# EAGLE design NS_ARM_Control_07_15_2017_full (EAGLE 6.6.0)
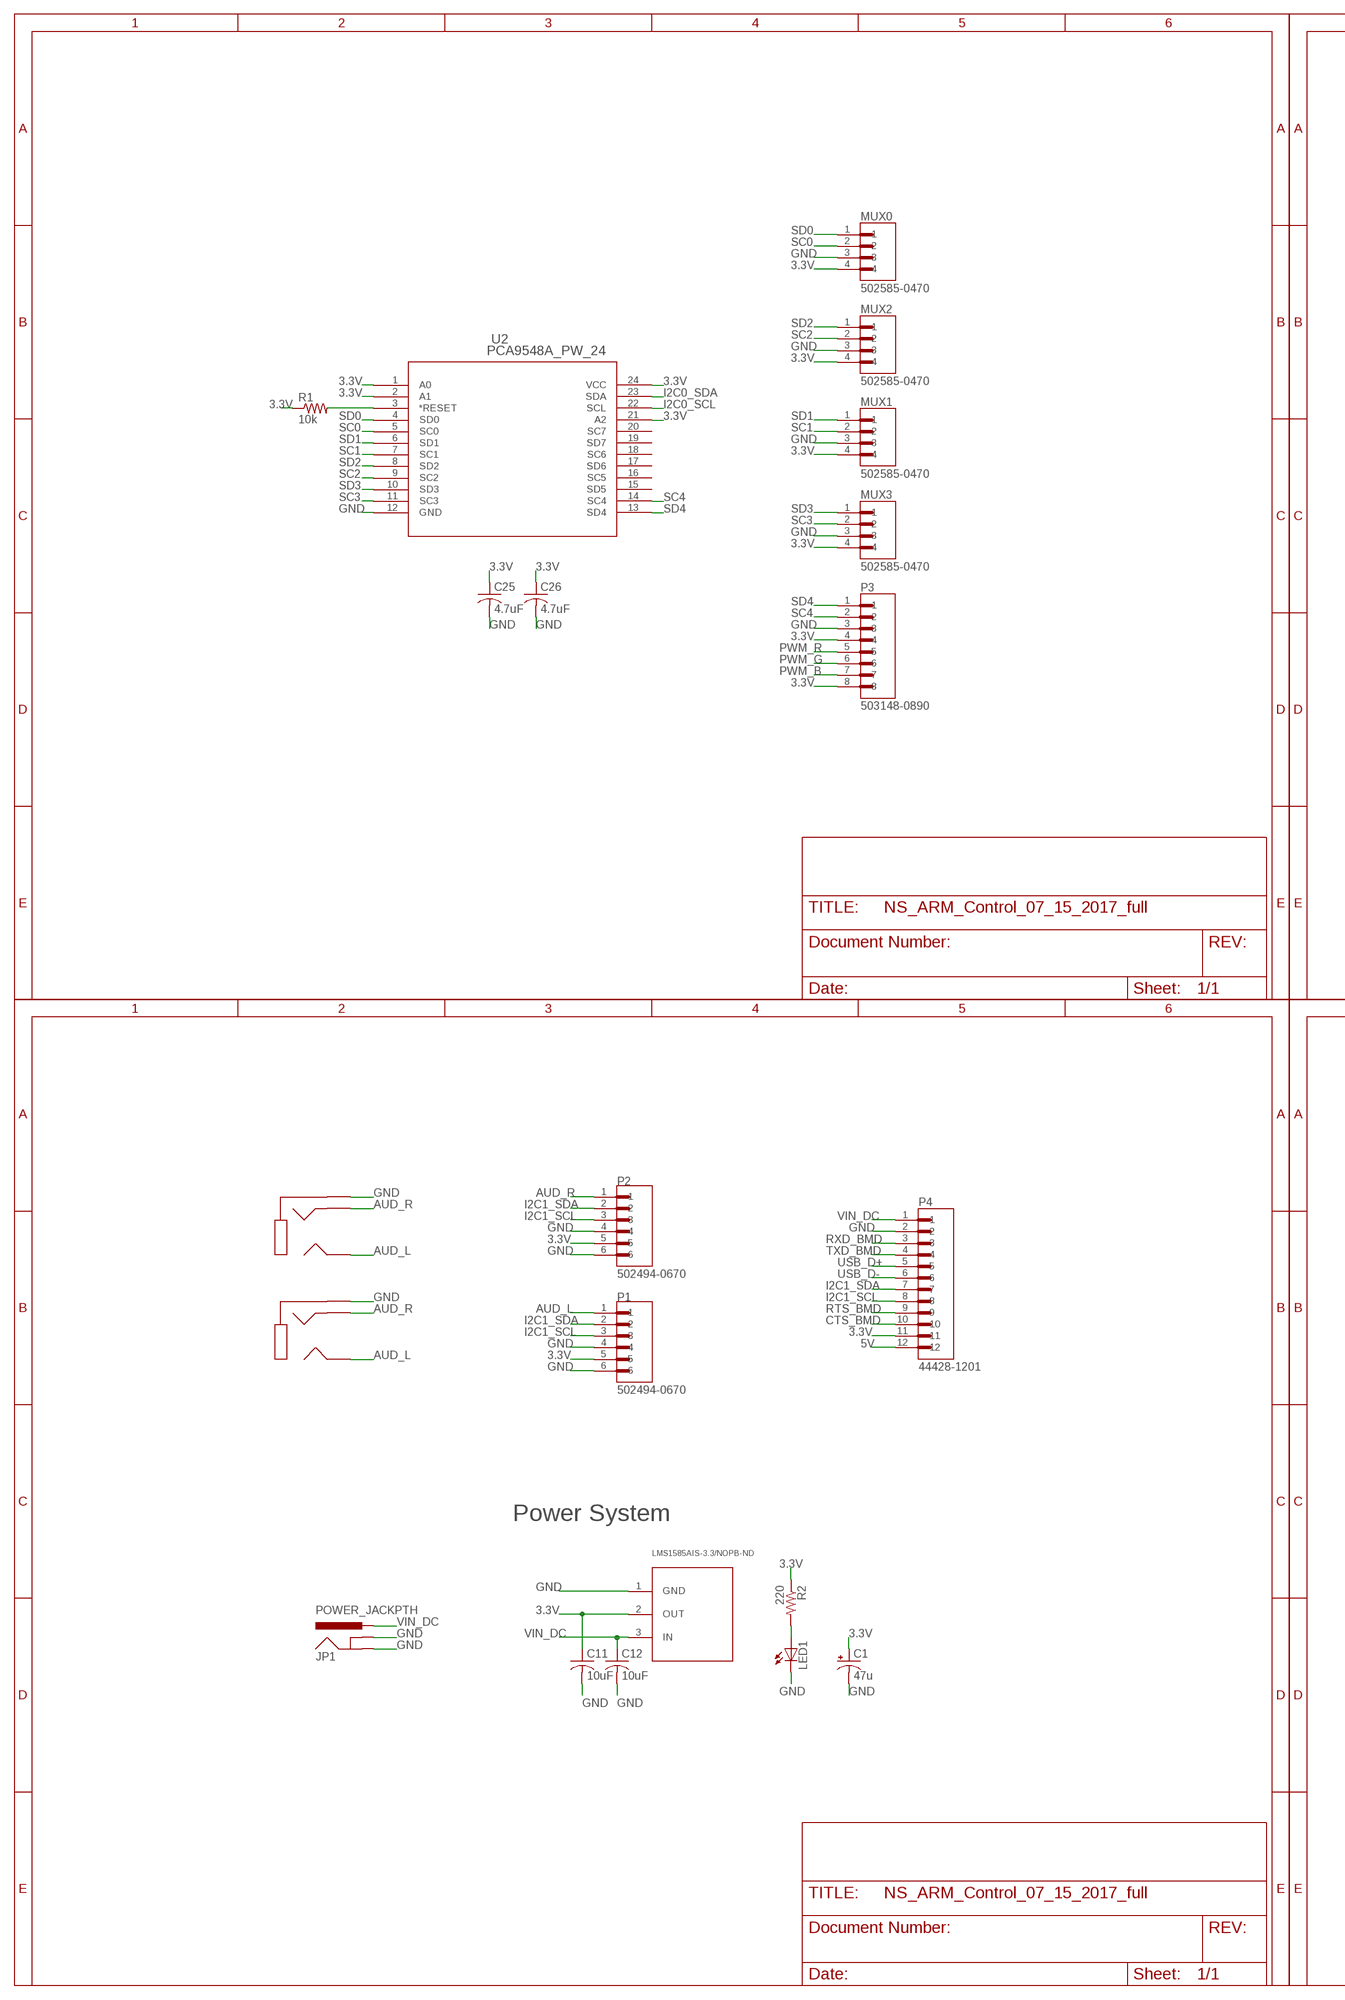
[diagram p0: schematic, sheet 1, part 1 of 2]
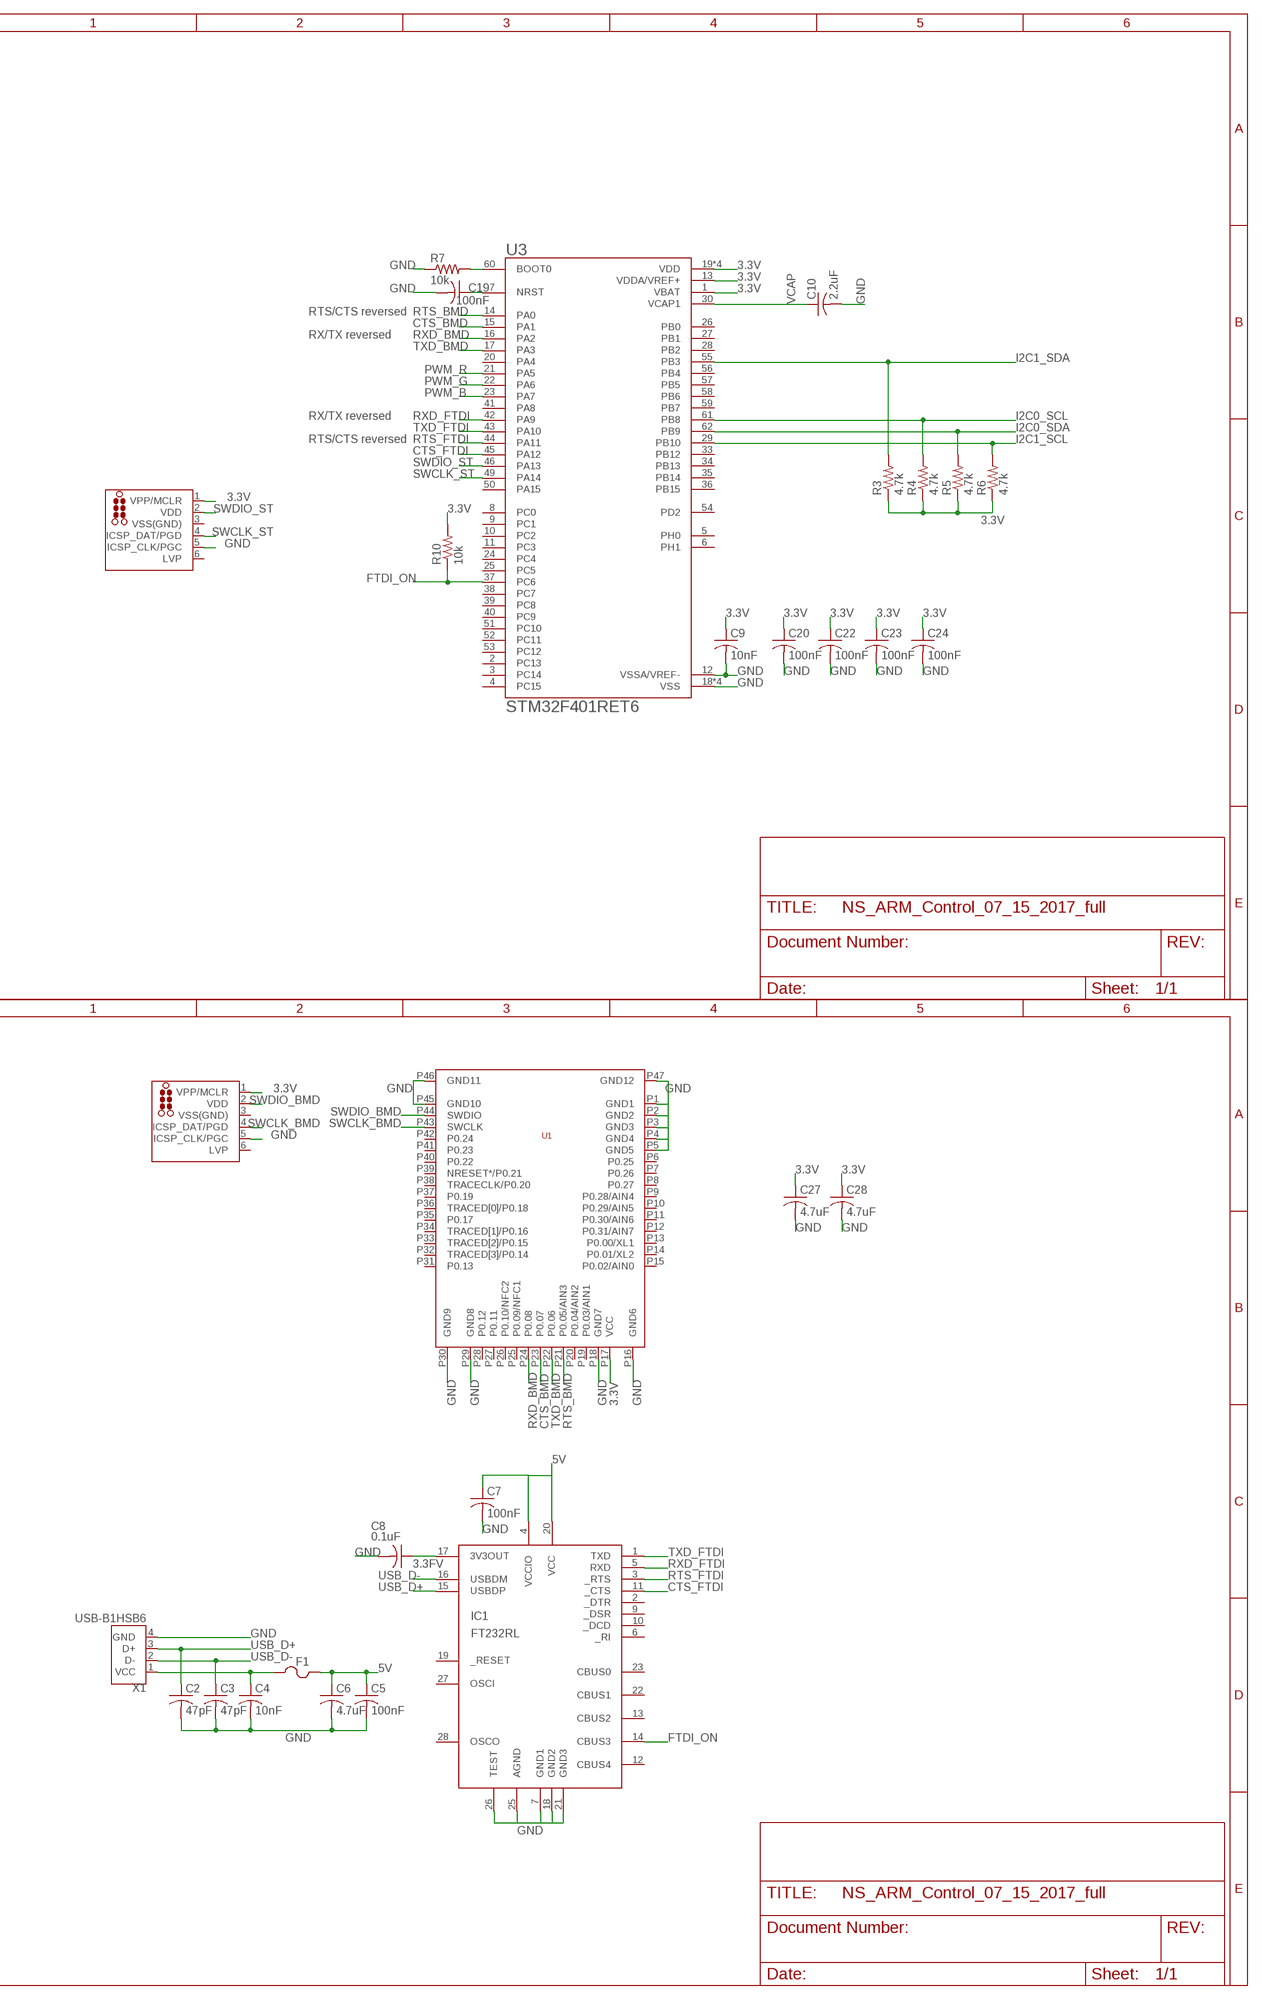
[diagram p1: schematic, sheet 1, part 2 of 2]

## Parts
C1  47u  CAP_POLD  [PANASONIC_D]
C2  47pF  C-USC0402  [C0402]
C3  47pF  C-USC0402  [C0402]
C4  10nF  C-USC0402  [C0402]
C5  100nF  C-USC0402  [C0402]
C6  4.7uF  C-USC0402  [C0402]
C7  100nF  C-USC0402  [C0402]
C8  0.1uF  C-USC0402  [C0402]
C9  10nF  C-USC0402  [C0402]
C10  2.2uF  C-USC0402  [C0402]
C11  10uF  C-USC0603  [C0603]
C12  10uF  C-USC0603  [C0603]
C19  100nF  C-USC0402  [C0402]
C20  100nF  C-USC0402  [C0402]
C22  100nF  C-USC0402  [C0402]
C23  100nF  C-USC0402  [C0402]
C24  100nF  C-USC0402  [C0402]
C25  4.7uF  C-USC0402  [C0402]
C26  4.7uF  C-USC0402  [C0402]
C27  4.7uF  C-USC0402  [C0402]
C28  4.7uF  C-USC0402  [C0402]
F1  1206L050YR  [1206LSERIES]
IC1  FT232RL  [SSOP28DB]
J_BMD  TC2030-MCP-NL  [TC2030-MCP-NL]
J_ST  TC2030-MCP-NL  [TC2030-MCP-NL]
JP1  POWER_JACKPTH  [POWER_JACK_PTH]
LED1  LEDCHIP-LED0603  [CHIP-LED0603]
MUX0  502585-0470  [MOLEX_502585-0470]
MUX1  502585-0470  [MOLEX_502585-0470]
MUX2  502585-0470  [MOLEX_502585-0470]
MUX3  502585-0470  [MOLEX_502585-0470]
P1  502494-0670  [MOLEX_502494-0670]
P2  502494-0670  [MOLEX_502494-0670]
P3  503148-0890  [MOLEX_503148-0890]
P4  44428-1201  [MOLEX_44428-1201]
R1  10k  R-US_R0603  [R0603]
R2  220  R-US_R0402  [R0402]
R3  4.7k  R-US_R0402  [R0402]
R4  4.7k  R-US_R0402  [R0402]
R5  4.7k  R-US_R0402  [R0402]
R6  4.7k  R-US_R0402  [R0402]
R7  10k  R-US_R0402  [R0402]
R10  10k  R-US_R0402  [R0402]
U1  BMD-300  [BMD-300]
U2  PCA9548A_PW_24  [PW24]
U3  STM32F401RET6  [QFP50P1200X1200X160-64N]
U$3  SJ1-3513N  [SJ1-351XN]
U$4  SJ1-3513N  [SJ1-351XN]
U$6  LMS1585AIS-3.3/NOPB-ND  [TO254P1524X483-4N]
X1  USB-B1HSB6  [OST_USB-B1HSB6]

## Nets
3.3FV: C8.1 IC1.17(3V3OUT)
3.3V: C1.+ C9.1 C11.1 C20.1 C22.1 C23.1 C24.1 C25.1 C26.1 C27.1 C28.1 J_BMD.1(VPP/MCLR) J_ST.1(VPP/MCLR) MUX0.4 MUX1.4 MUX2.4 MUX3.4 P1.5 P2.5 P3.4 P3.8 P4.11 R1.1 R2.1 R3.1 R4.1 R5.1 R6.1 R10.2 U1.P17(VCC) U2.1(A0) U2.2(A1) U2.21(A2) U2.24(VCC) U3.1(VBAT) U3.13(VDDA/VREF+) U3.19(VDD) U3.32(VDD) U3.48(VDD) U3.64(VDD) U$6.2(OUT)
5V: C5.1 C6.1 C7.1 F1.2 IC1.4(VCCIO) IC1.20(VCC) P4.12
AUD_L: P1.1 U$3.2 U$4.2
AUD_R: P2.1 U$3.3 U$4.3
CTS_BMD: P4.10 U1.P23(P0.07) U3.15(PA1)
CTS_FTDI: IC1.11(_CTS) U3.45(PA12)
FTDI_ON: IC1.14(CBUS3) R10.1 U3.37(PC6)
GND: C1.- C2.2 C3.2 C4.2 C5.2 C6.2 C7.2 C8.2 C9.2 C10.2 C11.2 C12.2 C19.2 C20.2 C22.2 C23.2 C24.2 C25.2 C26.2 C27.2 C28.2 IC1.7(GND1) IC1.18(GND2) IC1.21(GND3) IC1.25(AGND) IC1.26(TEST) J_BMD.5(ICSP_CLK/PGC) J_ST.5(ICSP_CLK/PGC) JP1.GND JP1.GNDBREAK LED1.C MUX0.3 MUX1.3 MUX2.3 MUX3.3 P1.4 P1.6 P2.4 P2.6 P3.3 P4.2 R7.1 U1.P1(GND1) U1.P2(GND2) U1.P3(GND3) U1.P4(GND4) U1.P5(GND5) U1.P16(GND6) U1.P18(GND7) U1.P29(GND8) U1.P30(GND9) U1.P45(GND10) U1.P46(GND11) U1.P47(GND12) U2.12(GND) U3.12(VSSA/VREF-) U3.18(VSS) U3.31(VSS) U3.47(VSS) U3.63(VSS) U$3.1 U$4.1 U$6.1(GND) X1.4(GND)
I2C0_SCL: R4.2 U2.22(SCL) U3.61(PB8)
I2C0_SDA: R5.2 U2.23(SDA) U3.62(PB9)
I2C1_SCL: P1.3 P2.3 P4.8 R6.2 U3.29(PB10)
I2C1_SDA: P1.2 P2.2 P4.7 R3.2 U3.55(PB3)
N$1: R1.2 U2.3(*RESET)
N$2: C4.1 F1.1 X1.1(VCC)
N$3: LED1.A R2.2
N$4: C19.1 U3.7(NRST)
N$5: R7.2 U3.60(BOOT0)
PWM_B: P3.7 U3.23(PA7)
PWM_G: P3.6 U3.22(PA6)
PWM_R: P3.5 U3.21(PA5)
RTS_BMD: P4.9 U1.P21(P0.05/AIN3) U3.14(PA0)
RTS_FTDI: IC1.3(_RTS) U3.44(PA11)
RXD_BMD: P4.3 U1.P24(P0.08) U3.16(PA2)
RXD_FTDI: IC1.5(RXD) U3.42(PA9)
SC0: MUX0.2 U2.5(SC0)
SC1: MUX1.2 U2.7(SC1)
SC2: MUX2.2 U2.9(SC2)
SC3: MUX3.2 U2.11(SC3)
SC4: P3.2 U2.14(SC4)
SD0: MUX0.1 U2.4(SD0)
SD1: MUX1.1 U2.6(SD1)
SD2: MUX2.1 U2.8(SD2)
SD3: MUX3.1 U2.10(SD3)
SD4: P3.1 U2.13(SD4)
SWCLK_BMD: J_BMD.4(ICSP_DAT/PGD) U1.P43(SWCLK)
SWCLK_ST: J_ST.4(ICSP_DAT/PGD) U3.49(PA14)
SWDIO_BMD: J_BMD.2(VDD) U1.P44(SWDIO)
SWDIO_ST: J_ST.2(VDD) U3.46(PA13)
TXD_BMD: P4.4 U1.P22(P0.06) U3.17(PA3)
TXD_FTDI: IC1.1(TXD) U3.43(PA10)
USB_D+: C2.1 IC1.15(USBDP) P4.5 X1.3(D+)
USB_D-: C3.1 IC1.16(USBDM) P4.6 X1.2(D-)
VCAP: C10.1 U3.30(VCAP1)
VIN_DC: C12.1 JP1.PWR P4.1 U$6.3(IN)
Unconnected: IC1.2(_DTR) IC1.6(_RI) IC1.9(_DSR) IC1.10(_DCD) IC1.12(CBUS4) IC1.13(CBUS2) IC1.19(_RESET) IC1.22(CBUS1) IC1.23(CBUS0) IC1.27(OSCI) IC1.28(OSCO) J_BMD.6(LVP) J_ST.6(LVP) U1.P6(P0.25) U1.P7(P0.26) U1.P8(P0.27) U1.P9(P0.28/AIN4) U1.P10(P0.29/AIN5) U1.P11(P0.30/AIN6) U1.P12(P0.31/AIN7) U1.P13(P0.00/XL1) U1.P14(P0.01/XL2) U1.P15(P0.02/AIN0) U1.P19(P0.03/AIN1) U1.P20(P0.04/AIN2) U1.P25(P0.09/NFC1) U1.P26(P0.10/NFC2) U1.P27(P0.11) U1.P28(P0.12) U1.P31(P0.13) U1.P32(TRACED[3]/P0.14) U1.P33(TRACED[2]/P0.15) U1.P34(TRACED[1]/P0.16) U1.P35(P0.17) U1.P36(TRACED[0]/P0.18) U1.P37(P0.19) U1.P38(TRACECLK/P0.20) U1.P39(NRESET*/P0.21) U1.P40(P0.22) U1.P41(P0.23) U1.P42(P0.24) U2.15(SD5) U2.16(SC5) U2.17(SD6) U2.18(SC6) U2.19(SD7) U2.20(SC7) U3.2(PC13) U3.3(PC14) U3.4(PC15) U3.5(PH0) U3.6(PH1) U3.8(PC0) U3.9(PC1) U3.10(PC2) U3.11(PC3) U3.20(PA4) U3.24(PC4) U3.25(PC5) U3.26(PB0) U3.27(PB1) U3.28(PB2) U3.33(PB12) U3.34(PB13) U3.35(PB14) U3.36(PB15) U3.38(PC7) U3.39(PC8) U3.40(PC9) U3.41(PA8) U3.50(PA15) U3.51(PC10) U3.52(PC11) U3.53(PC12) U3.54(PD2) U3.56(PB4) U3.57(PB5) U3.58(PB6) U3.59(PB7)

## Notes on the sheet
- RTS/CTS reversed
- RX/TX reversed
- RX/TX reversed
- RTS/CTS reversed
- Power System

## Power pins joined to a net without a drawn wire
VSS(GND): J_BMD.3(VSS(GND)) J_ST.3(VSS(GND))

## Library data of the parts
C1 = SparkFun-Capacitors:CAP_POL: Capacitor Polarized These are standard SMD and PTH capacitors. Normally 10uF, 47uF, and 100uF in electrolytic and tantalum varieties. Always verify the external diameter of the through hole cap, it varies with capacity, voltage, and manufacturer. The EIA devices should be standard.
C2-C12 C19 C20 C22-C28 = rcl:C-US: CAPACITOR, American symbol
F1 = 1206L050:1206L050YR; COPYRIGHT: Copyright C 2015 Accelerated Designs. All rights reserved; MANUFACTURER_PART_NUMBER: 1206L050YR; VENDOR: Littelfuse Inc
IC1 = ftdichip-3:FT232RL: USB UART 4th Generation USB UART (USB <-> Serial) Controller
J_BMD J_ST = tag-connect:TC2030: TAG-CONNECT ICSP Connector Manufacturer: Tag-Connect <http://www.tag-connect.com> Cable for easy In-Circuit Serial Programming. Designed for Microchip ICD2, suitable for many others. Two variants - one "with legs" (for hands-free fit on PCB) and another "without legs" for quick programming. PAD Description 1 MCLR/Vpp 2 Vdd 3 GND 4 PGD (ISPDAT) 5 PGC (ISPCLK) 6 nc (used for LVP) ©2009 ROFA.cz - modified and updated by Robert Darlington ‹rdarlington@gmail.com›
JP1 = SparkFun-Connectors:POWER_JACK: Power Jack This is the standard 5.5mm barrel jack for power. The PTH is the most common, proven, reliable, footprint. The Slot footprint only works if the mill layer is transmitted to the PCB fab house so be warned. Mating wall wart : TOL-00298 (and others); PROD_ID: CONN-08197
LED1 = led:LED: LED OSRAM: - CHIPLED LG R971, LG N971, LY N971, LG Q971, LY Q971, LO R971, LY R971 LH N974, LH R974 LS Q976, LO Q976, LY Q976 LO Q996 - Hyper CHIPLED LW Q18S LB Q993, LB Q99A, LB R99A - SideLED LS A670, LO A670, LY A670, LG A670, LP A670 LB A673, LV A673, LT A673, LW A673 LH A674 LY A675 LS A676, LA A676, LO A676, LY A676, LW A676 LS A679, LY A679, LG A679 - Hyper Micro SIDELED® LS Y876, LA Y876, LO Y876, LY Y876 LT Y87S - SmartLED LW L88C, LW L88S LB L89C, LB L89S, LG L890 LS L89K, LO L89K, LY L89K LS L896, LA L896, LO L896, LY L896 - TOPLED LS T670, LO T670, LY T670, LG T670, LP T670 LSG T670, LSP T670, LSY T670, LOP T670, LYG T670 LG T671, LOG T671, LSG T671 LB T673, LV T673, LT T673, LW T673 LH T674 LS T676, LA T676, LO T676, LY T676, LB T676, LH T676, LSB T676, LW T676 LB T67C, LV T67C, LT T67C, LS T67K, LO T67K, LY T67K, LW E67C LS E67B, LA E67B, LO E67B, LY E67B, LB E67C, LV E67C, LT E67C LW T67C LS T679, LY T679, LG T679 LS T770, LO T770, LY T770, LG T770, LP T770 LB T773, LV T773, LT T773, LW T773 LH T774 LS E675, LA E675, LY E675, LS T675 LS T776, LA T776, LO T776, LY T776, LB T776 LHGB T686 LT T68C, LB T68C - Hyper Mini TOPLED® LB M676 - Mini TOPLED Santana® LG M470 LS M47K, LO M47K, LY M47K Source: http://www.osram.convergy.de LUXEON: - LUMILED® LXK2-PW12-R00, LXK2-PW12-S00, LXK2-PW14-U00, LXK2-PW14-V00 LXK2-PM12-R00, LXK2-PM12-S00, LXK2-PM14-U00 LXK2-PE12-Q00, LXK2-PE12-R00, LXK2-PE12-S00, LXK2-PE14-T00, LXK2-PE14-U00 LXK2-PB12-K00, LXK2-PB12-L00, LXK2-PB12-M00, LXK2-PB14-N00, LXK2-PB14-P00, LXK2-PB14-Q00 LXK2-PR12-L00, LXK2-PR12-M00, LXK2-PR14-Q00, LXK2-PR14-R00 LXK2-PD12-Q00, LXK2-PD12-R00, LXK2-PD12-S00 LXK2-PH12-R00, LXK2-PH12-S00 LXK2-PL12-P00, LXK2-PL12-Q00, LXK2-PL12-R00 Source: www.luxeon.com KINGBRIGHT: KA-3528ASYC Source: www.kingbright.com
MUX0 MUX1-MUX3 = 502585-0470:502585-0470: 1.50mm Pitch CLIK-Mate™ Wire-to-Board PCB Receptacle, Single Row, Right Angle, 4 Circuits; AVAILABILITY: Good; DESCRIPTION: 1.50mm Pitch CLIK-Mate™ Wire-to-Board PCB Receptacle, Single Row, Right Angle, 4 Circuits; MF: Molex; MP: 502585-0470; PACKAGE: None; PRICE: 0.44 USD
P1 P2 = 502494-0670:502494-0670: 2.00mm Pitch CLIK-Mate™ Wire-to-Board PCB Receptacle, Single Row, Right Angle, 6 Circuits; AVAILABILITY: Good; DESCRIPTION: 2.00mm Pitch CLIK-Mate™ Wire-to-Board PCB Receptacle, Single Row, Right Angle, 6 Circuits; MF: Molex; MP: 502494-0670; PACKAGE: None; PRICE: 0.53 USD
P3 = 503148-0890:503148-0890: 1.5wb Dual r/a Embs Tape Pkg 8p; AVAILABILITY: Good; DESCRIPTION: 1.5wb Dual r/a Embs Tape Pkg 8p; MF: Molex; MP: 503148-0890; PACKAGE: None; PRICE: 1.11 USD
P4 = 44428-1201:44428-1201: Conn Wire to Board HDR 12 POS 3mm Solder RA Thru-Hole Micro-Fit 3.0 BMI? Tray; AVAILABILITY: Good; DESCRIPTION: Conn Wire to Board HDR 12 POS 3mm Solder RA Thru-Hole Micro-Fit 3.0 BMI? Tray; MF: Molex; MP: 44428-1201; PACKAGE: None; PRICE: 2.39 USD
R1 = resistor:R-US_: RESISTOR, American symbol
R2-R7 R10 = rcl:R-US_: RESISTOR, American symbol
U1 = BMD-300:BMD-300
U2 = PCA9548A_PW_124:PCA9548A_PW_24; DATASHEETURL: http://www.ti.com/lit/gpn/PCA9548A; DESCRIPTION: 8-Channel I2C Switch With Reset; FAMILY_NAME: I2C MULTIPLEXER, SWITCH; GENERIC_PART_NUMBER: PCA9548A; INDUSTRY_STD_PKG_TYPE: TSSOP; MANUFACTURER: Texas Instruments; MANUFACTURER_PART_NUMBER: pca9548a_pw_24; PACKAGE_DESIGNATOR: PW; PIN_COUNT: 24; VENDOR: Texas Instruments
U3 = STM32F401RET6:STM32F401RET6: MCU 32-Bit STM32 ARM Cortex M4 RISC 512KB Flash 1.8V/2.5V/3.3V 64-Pin LQFP Tray; AVAILABILITY: Good; DESCRIPTION: MCU 32-Bit STM32 ARM Cortex M4 RISC 512KB Flash 1.8V/2.5V/3.3V 64-Pin LQFP Tray; MF: STMicroelectronics; MP: STM32F401RET6; PACKAGE: LQFP-64 STMicroelectronics; PRICE: 4.74 USD
U$3 U$4 = audio_mux:SJ1-3513N
U$6 = TO254P1524X483-4N:LMS1585AIS-3.3/NOPB-ND
X1 = USB-B1HSB6:USB-B1HSB6: Conn Usb Type b r/a Black; AVAILABILITY: Warning; DESCRIPTION: Conn Usb Type b r/a Black; MF: On Shore Technology; MP: USB-B1HSB6; PACKAGE: None; PRICE: 0.42 USD

## Board
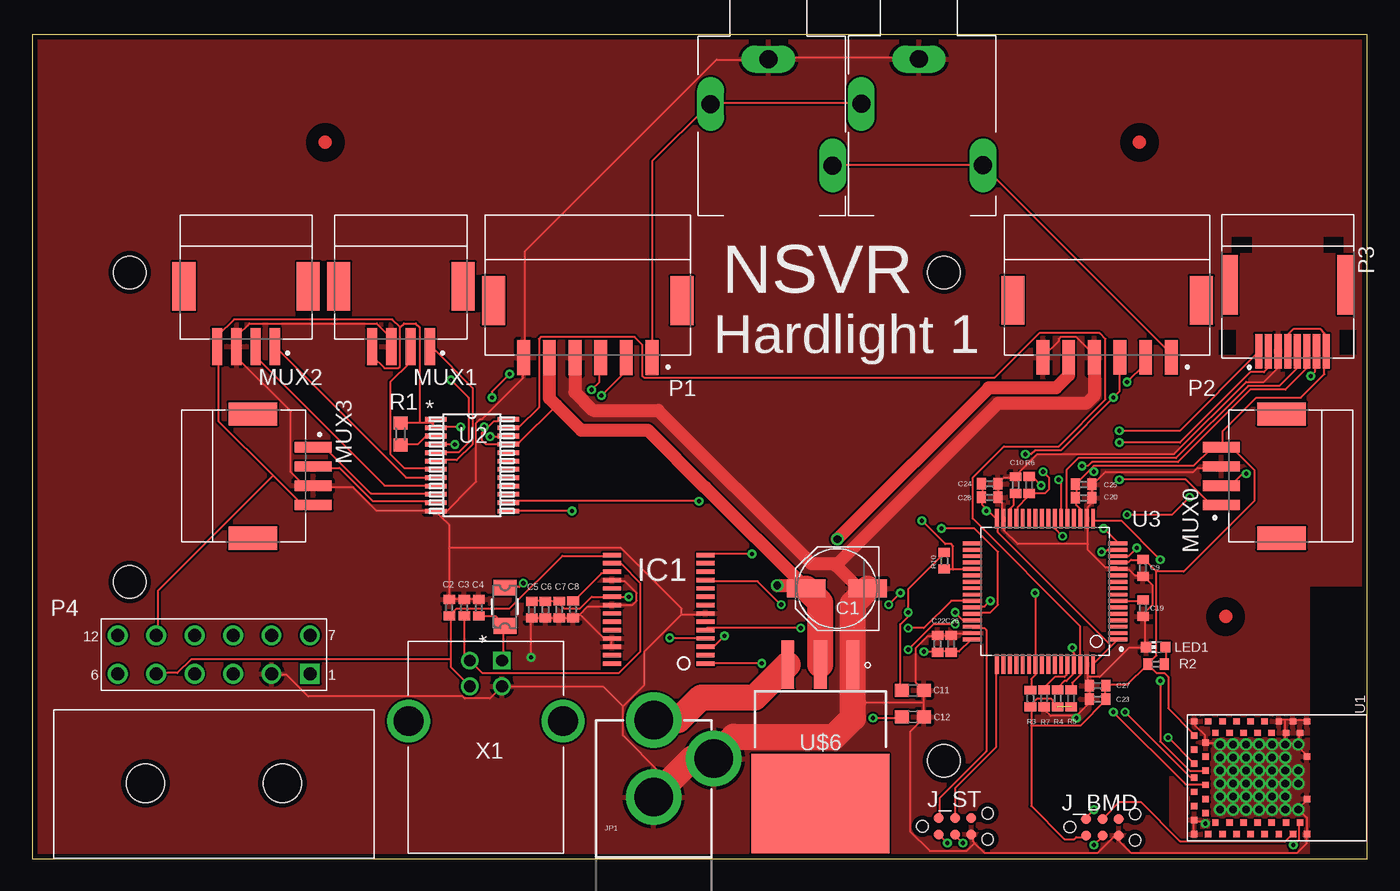
[diagram p2: board, top side]
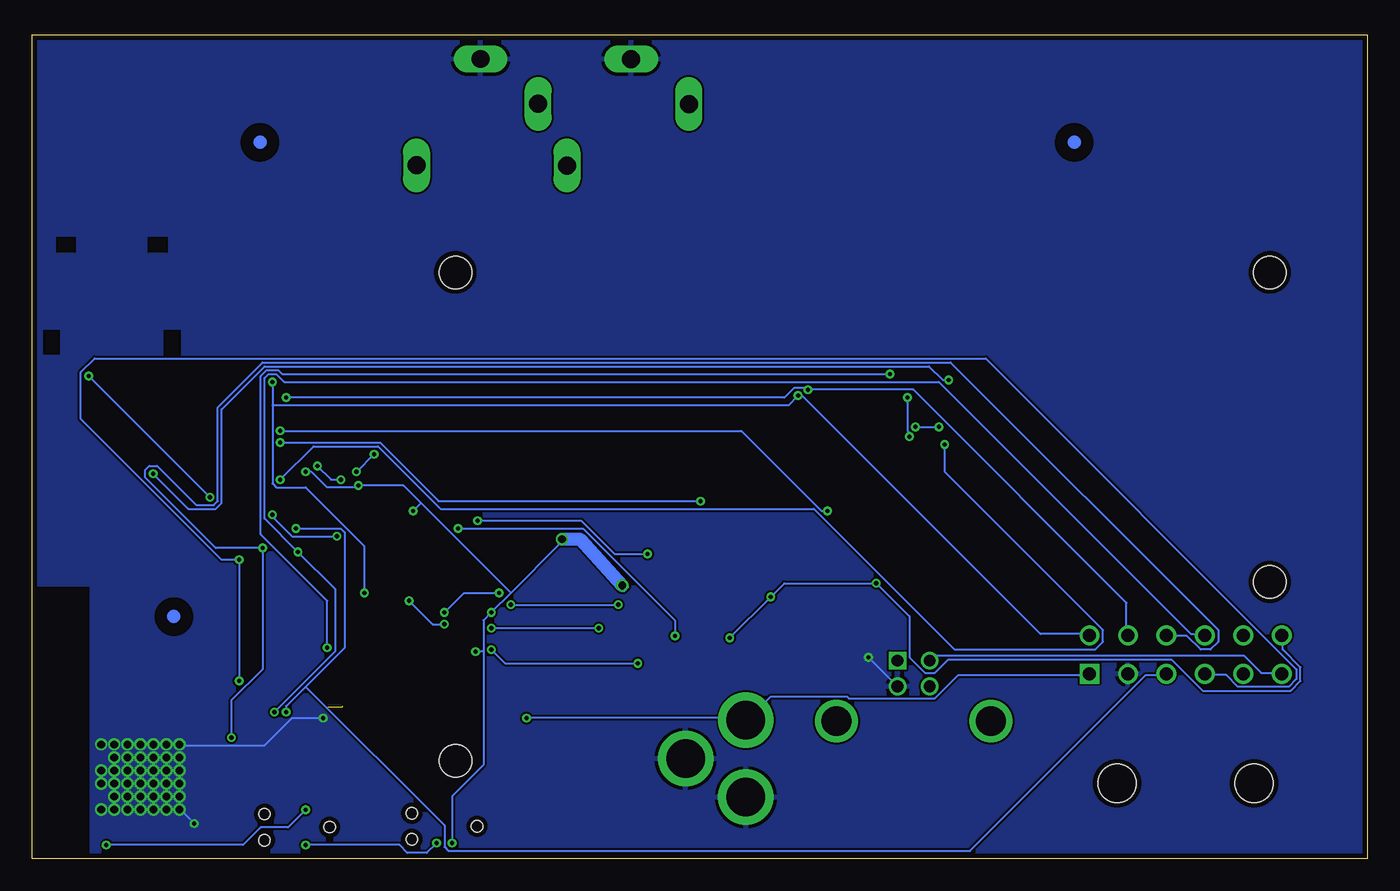
[diagram p3: board, bottom side, seen from below]

Size 104.14 x 64.26 mm. Coordinates in mm from the lower left corner, seen from the top.
Outline: 104.14,0 104.14,64.26 0,64.26 0,0 104.14,0
Copper layers (1*16): Top 0.0356mm / dielectric 1.5011mm / Bottom 0.0356mm
Design rules "LaenPCBOrder (OSH Park)": minimum track width 6mil, minimum drill 13mil, track to track 6mil, track to pad 6mil, pad to pad 6mil, via to via 6mil, smd to smd 6mil, copper to edge 15mil, drill to drill 6mil, minimum pad ring 7mil, minimum via ring 7mil, stop-mask expansion 3mil, vias tented up to drill 0mil, thermal gap 10mil
Holes 2.54 mm at 71.12,45.72 7.62,45.72 71.12,7.62 7.62,21.59

### Footprints (pad centres in the part's own frame; a part is rotated, then mirrored left to right if it is on the bottom)
PANASONIC_D = smd 3 x 1.4: + 2.4,0; - -2.4,0
C0402 = smd 0.7 x 0.9: 1 -0.65,0; 2 0.65,0
C0603 = smd 1.1 x 1: 1 -0.85,0; 2 0.85,0
1206LSERIES = smd 1.219 x 1.778: 1 -1.499,0; 2 1.499,0
SSOP28DB = smd 0.348 x 1.397: 1 -4.225,-3.656; 2 -3.575,-3.656; 3 -2.925,-3.656; 4 -2.275,-3.656; 5 -1.625,-3.656; 6 -0.975,-3.656; 7 -0.325,-3.656; 8 0.325,-3.656; 9 0.975,-3.656; 10 1.625,-3.656; 11 2.275,-3.656; 12 2.925,-3.656; 13 3.575,-3.656; 14 4.225,-3.656; 15 4.225,3.656; 16 3.575,3.656; 17 2.925,3.656; 18 2.275,3.656; 19 1.625,3.656; 20 0.975,3.656; 21 0.325,3.656; 22 -0.325,3.656; 23 -0.975,3.656; 24 -1.625,3.656; 25 -2.275,3.656; 26 -2.925,3.656; 27 -3.575,3.656; 28 -4.225,3.656
TC2030-MCP-NL = smd 0.787 x 0.787: 1 1.27,-0.635; 2 1.27,0.635; 3 2.54,-0.635; 4 2.54,0.635; 5 3.81,-0.635; 6 3.81,0.635 | hole 0.889: 0,0; 5.08,-1.016; 5.08,1.016
POWER_JACK_PTH = drill 2.997 pad 4.318: GND 0,7.7; GNDBREAK 4.7,10.7; PWR 0,13.7
CHIP-LED0603 = smd 0.8 x 0.8: A 0,-0.75; C 0,0.75
MOLEX_502585-0470 = smd 0.8 x 2.9: 1 -2.25,0; 2 -0.75,0; 3 0.75,0; 4 2.25,0 | smd 1.8 x 3.8: P1 -4.85,-4.7; P2 4.85,-4.7
MOLEX_502494-0670 = smd 1 x 2.7: 1 -5,0; 2 -3,0; 3 -1,0; 4 1,0; 5 3,0; 6 5,0 | smd 1.8 x 3.8: P1 -7.35,-4.45; P2 7.35,-4.45
MOLEX_503148-0890 = smd 0.55 x 2.7: 1 2.25,0; 2 1.5,0; 3 0.75,0; 4 0,0; 5 -0.75,0; 6 -1.5,0; 7 -2.25,0; 8 -3,0 | smd 1.2 x 4.65: P1 -4.48,-5.175; P2 4.48,-5.175
MOLEX_44428-1201 = drill 1.02 square: 1 7.5,5.065 | drill 1.02: 2 4.5,5.065; 3 1.5,5.065; 4 -1.5,5.065; 5 -4.5,5.065; 6 -7.5,5.065; 7 7.5,8.065; 8 4.5,8.065; 9 1.5,8.065; 10 -1.5,8.065; 11 -4.5,8.065; 12 -7.5,8.065 | hole 3: -5.34,-3.465; 5.34,-3.465
R0603 = smd 1 x 1.1: 1 -0.85,0; 2 0.85,0
R0402 = smd 0.7 x 0.9: 1 -0.65,0; 2 0.65,0
BMD-300 = smd 0.5 x 0.5: P1 0.5,9.35; P2 1.4,8.8; P3 0.5,8.25; P4 1.4,7.7; P5 0.5,7.15; P6 1.4,6.6; P7 0.5,6.05; P8 1.4,5.5; P9 0.5,4.95; P10 1.4,4.4; P11 0.5,3.85; P12 1.4,3.3; P13 0.5,2.75; P14 1.4,2.2; P15 0.5,1.65; P16 0.5,0.55; P17 1.6,0.55; P18 2.15,1.45; P19 2.7,0.55; P20 3.25,1.45; P21 3.8,0.55; P22 4.35,1.45; P23 4.9,0.55; P24 5.45,1.45; P25 6,0.55; P26 6.55,1.45; P27 7.1,0.55; P28 7.65,1.45; P29 8.2,0.55; P30 9.3,0.55; P31 9.3,1.65; P32 8.4,2.2; P33 9.3,2.75; P34 8.4,3.3; P35 9.3,3.85; P36 8.4,4.4; P37 9.3,4.95; P38 8.4,5.5; P39 9.3,6.05; P40 8.4,6.6; P41 9.3,7.15; P42 8.4,7.7; P43 9.3,8.25; P44 8.4,8.8; P45 9.3,9.35; P46 6.55,9.35; P47 3.25,9.35
PW24 = smd 1.676 x 0.356: 1 -2.819,3.575; 2 -2.819,2.925; 3 -2.819,2.275; 4 -2.819,1.625; 5 -2.819,0.975; 6 -2.819,0.325; 7 -2.819,-0.325; 8 -2.819,-0.975; 9 -2.819,-1.625; 10 -2.819,-2.275; 11 -2.819,-2.925; 12 -2.819,-3.575; 13 2.819,-3.575; 14 2.819,-2.925; 15 2.819,-2.275; 16 2.819,-1.625; 17 2.819,-0.975; 18 2.819,-0.325; 19 2.819,0.325; 20 2.819,0.975; 21 2.819,1.625; 22 2.819,2.275; 23 2.819,2.925; 24 2.819,3.575
QFP50P1200X1200X160-64N = smd 1.5 x 0.3: 1 -5.67,3.75; 2 -5.67,3.25; 3 -5.67,2.75; 4 -5.67,2.25; 5 -5.67,1.75; 6 -5.67,1.25; 7 -5.67,0.75; 8 -5.67,0.25; 9 -5.67,-0.25; 10 -5.67,-0.75; 11 -5.67,-1.25; 12 -5.67,-1.75; 13 -5.67,-2.25; 14 -5.67,-2.75; 15 -5.67,-3.25; 16 -5.67,-3.75; 33 5.67,-3.75; 34 5.67,-3.25; 35 5.67,-2.75; 36 5.67,-2.25; 37 5.67,-1.75; 38 5.67,-1.25; 39 5.67,-0.75; 40 5.67,-0.25; 41 5.67,0.25; 42 5.67,0.75; 43 5.67,1.25; 44 5.67,1.75; 45 5.67,2.25; 46 5.67,2.75; 47 5.67,3.25; 48 5.67,3.75 | smd 0.3 x 1.5: 17 -3.75,-5.67; 18 -3.25,-5.67; 19 -2.75,-5.67; 20 -2.25,-5.67; 21 -1.75,-5.67; 22 -1.25,-5.67; 23 -0.75,-5.67; 24 -0.25,-5.67; 25 0.25,-5.67; 26 0.75,-5.67; 27 1.25,-5.67; 28 1.75,-5.67; 29 2.25,-5.67; 30 2.75,-5.67; 31 3.25,-5.67; 32 3.75,-5.67; 49 3.75,5.67; 50 3.25,5.67; 51 2.75,5.67; 52 2.25,5.67; 53 1.75,5.67; 54 1.25,5.67; 55 0.75,5.67; 56 0.25,5.67; 57 -0.25,5.67; 58 -0.75,5.67; 59 -1.25,5.67; 60 -1.75,5.67; 61 -2.25,5.67; 62 -2.75,5.67; 63 -3.25,5.67; 64 -3.75,5.67
SJ1-351XN = drill 1.4 long: 1 0.8,0; 2 4.3,-4.5; 3 9.1,5
TO254P1524X483-4N = smd 3.8 x 1: 1 -6.4,2.54; 2 -6.4,0; 3 -6.4,-2.54 | smd 7.75 x 10.75: TAB 4.45,0
OST_USB-B1HSB6 = drill 0.92 square: 1 1.25,4.71 | drill 0.92: 2 -1.25,4.71; 3 -1.25,2.71; 4 1.25,2.71 | drill 2.33: P1 -6.02,0; P2 6.02,0

### Placement (x,y rotation side)
C1  62.78,21.07 180 top
C2  32.53,19.58 90 top
C3  33.7,19.58 90 top
C4  34.84,19.57 90 top
C5  38.97,19.41 270 top
C6  40.04,19.42 270 top
C7  41.12,19.44 270 top
C8  42.19,19.45 270 top
C9  86.63,22.68 270 top
C10  76.71,29.14 90 top
C11  68.69,13.13 0 top
C12  68.7,11.06 0 top
C19  86.63,19.54 270 top
C20  82,28.14 0 top
C22  70.61,16.76 90 top
C23  83.1,12.44 180 top
C24  74.67,29.24 0 top
C25  82,29.19 0 top
C26  71.67,16.76 90 top
C27  83.1,13.5 180 top
C28  74.67,28.18 0 top
F1  36.88,19.65 90 top
IC1  48.87,19.46 90 top
J_BMD  80.93,2.46 0 top
J_ST  69.44,2.52 0 top
JP1  48.47,-2.9 0 top
LED1  87.64,16.5 90 top
MUX0  92.73,29.84 90 top
MUX1  28.76,39.94 180 top
MUX2  16.7,39.95 180 top
MUX3  21.93,29.84 270 top
P1  43.34,39.09 180 top
P2  83.84,39.1 180 top
P3  97.92,39.58 180 top
P4  14.18,9.35 0 top
R1  28.73,33.13 270 top
R2  87.65,15.17 0 top
R3  77.85,12.5 90 top
R4  79.98,12.5 90 top
R5  81.04,12.51 90 top
R6  77.76,29.15 270 top
R7  78.92,12.5 90 top
R10  71.14,23.23 90 top
U1  90.08,11.21 270 top
U2  34.3,30.69 0 top
U3  79,20.84 180 top
U$1  [CIRCLE-1MM-3R]  22.86,55.88 0 top
U$2  [CIRCLE-1MM-3R]  86.36,55.88 0 top
U$3  69.16,63.18 270 top
U$4  57.42,63.16 270 top
U$5  [CIRCLE-1MM-3R]  93.09,18.89 0 top
U$6  61.48,8.74 270 top
X1  35.39,10.73 0 top

### Tracks (layer width: path | path; a pad name or v marks a point on that pad's centre or on a via)
3.3FV
  Top 0.152: C8.1 42.27,20.12 44.4,22.25 45.16,22.25 IC1.17
3.3V  (via drill 0.33, 0.6)  (2 unrouted)
  Top 0.152: 52.17,28.65 52.49,28.97 | 77.93,10.36 77.93,11.73 R3.1 77.78,11.89 78.38,12.5 79.45,12.5 79.6,12.34 79.6,12.19 79.91,11.89 | 77.93,10.36 77.93,4.12 80.52,1.52 81.28,1.52 81.43,1.68 82.19,1.68 J_BMD.1 | U3.13 84.78,23.16 85.55,23.16 85.7,23.32 86.61,23.32 C9.1 86.77,23.32 87.68,22.4 | U1.P17 90.58,9.75 88.59,11.73 88.59,14.17 88.29,14.48 87.68,14.48 87.07,15.09 R2.1 | R2.1 86.92,15.09 85.4,13.56 83.87,13.56 C27.1 83.72,13.41 83.72,12.5 C23.1 83.72,12.34 81.74,10.36 77.93,10.36 | 87.68,22.4 87.68,15.85 87.07,15.24 R2.1 | P3.4 98.04,39.62 98.04,41 98.35,41.3 100.48,41.3 100.79,41 100.79,39.62 P3.8 100.79,39.47 100.79,37.8 98.96,35.97 95.45,35.97 92.86,33.38 92.86,32.16 MUX0.4 | U3.19 81.74,26.52 81.74,27.28 81.43,27.58 81.43,28.04 C20.1 81.43,28.19 81.43,29.11 C25.1 81.43,29.26 82.5,30.33 | 82.5,30.33 82.8,30.63 90.58,30.63 91.95,32 92.71,32 MUX0.4 | 87.68,22.4 89.81,22.4 95.3,27.89 95.3,30.33 93.62,32 92.86,32 MUX0.4 | 31.14,33.98 31.29,33.98 31.44,34.14 U2.1 | 31.14,33.98 30.23,33.98 | 30.23,33.98 28.85,33.98 R1.1 | 31.14,33.98 31.44,33.68 U2.2 31.6,33.68 v33.43,33.68 | 30.23,33.98 30.23,41.45 29.92,41.76 29.01,41.76 28.7,41.45 | 28.7,41.45 28.7,38.41 28.55,38.25 27.48,38.25 26.57,39.17 26.57,39.93 MUX1.4 | 28.7,41.45 28.09,42.06 15.75,42.06 14.53,40.84 14.53,40.08 MUX2.4 14.53,39.93 14.53,34.14 18.8,29.87 | 18.8,29.87 20.93,27.74 21.84,27.74 MUX3.4 | 18.8,29.87 9.8,20.88 9.8,17.53 P4.11 | C24.1 74.12,29.11 74.12,28.19 C28.1 74.12,28.04 74.12,27.58 74.57,27.13 | 74.57,27.13 75.18,26.52 U3.32 75.34,26.36 75.34,25.45 84.18,16.61 | 84.18,16.61 84.63,17.07 U3.1
  Top 0.152: 84.18,16.61 82.8,15.24 U3.64 | R10.2 71.07,23.77 68.33,21.03 v68.33,19.2 68.33,18.9 67.72,18.29 67.72,13.26 C11.1 | U3.48 73.2,17.07 72.29,16.15 71.68,16.15 C26.1 71.53,16.15 70.76,16.15 C22.1 70.61,16.15 v69.55,16.15 | v71.37,1.22 70.76,1.83 J_ST.1 | v78.69,29.11 78.08,29.72 77.78,29.72 R6.1 | 40.89,35.36 38,32.46 37.24,32.46 U2.21 37.08,32.31 35.41,32.31 35.1,32.61 35.1,33.22 35.41,33.53 | 35.41,33.53 36.02,34.14 37.08,34.14 U2.24 | v74.42,27.13 74.57,27.13 | 35.41,33.53 v35.25,33.68 | 82.5,30.33 82.65,30.33 v82.8,30.18
  Top 1.016: P1.5 40.34,35.91 40.89,35.36 42.82,33.43 48.02,33.43 52.49,28.97 C1.+ 60.14,21.31 v58.11,21.31 | P2.5 80.84,37.69 79.86,36.72 74.61,36.72 v62.81,24.92
  Top 2.032: U$6.2 61.48,19.98 C1.+
  Bottom 0.152: 57.96,20.88 v58.11,21.31 57.66,21.18 | v71.37,1.22 71.37,4.88 68.94,7.32 68.94,16.15 | 68.94,16.15 68.94,18.59 v68.33,19.2 66.8,20.73 | 66.8,20.73 62.99,24.54 v62.81,24.92 | 66.8,20.73 73.81,27.74 | 73.81,27.74 75.18,29.11 v78.69,29.11 78.84,28.96 81.13,28.96 82.35,30.18 v82.8,30.18 | 68.94,16.15 v69.55,16.15 | 73.81,27.74 v74.42,27.13 | v35.25,33.68 v33.43,33.68
  Bottom 1.016: v62.81,24.92 61.41,24.92 v58.11,21.31
5V  (via drill 0.33)
  Top 0.152: C5.1 39.06,20.12 39.98,20.12 C6.1 40.13,20.12 41.05,20.12 C7.1 41.05,19.96 41.5,19.51 42.72,19.51 43.64,20.42 45.16,20.42 IC1.20 45.31,20.42 v46.53,20.42 | v49.73,17.22 52.48,17.22 IC1.4 | v38.3,21.49 38,21.18 36.93,21.18 F1.2
  Bottom 0.152: v49.73,17.22 v46.53,20.42 45.47,21.49 v38.3,21.49 35.71,18.9 35.71,15.7 34.49,14.48 33.73,14.48 32.66,15.54 15.29,15.54 12.85,13.11 5.99,13.11 5.23,13.87 5.23,14.94 6.6,16.31 6.6,17.37 P4.12
AUD_L
  Top 0.152: P1.1 48.36,39.17 48.36,54.41 52.78,58.83 U$4.2 52.93,58.98 64.52,58.98 U$3.2
AUD_R
  Top 0.152: P2.1 88.75,39.17 88.75,39.47 74.27,53.95 U$3.3 74.12,54.1 62.53,54.1 U$4.3
CTS_BMD  (via drill 0.33)
  Top 0.152: v85.24,11.43 90.27,6.4 90.58,6.4 U1.P23 | v83.41,23.93 83.72,23.93 83.87,24.08 84.63,24.08 U3.15
  Bottom 0.152: v85.24,11.43 80.52,16.15 80.52,21.03 v83.41,23.93 86,26.52 86,37.49 85.7,37.8 85.09,37.8 84.48,37.19 33.43,37.19 13.77,17.53 12.7,17.53 P4.10
CTS_FTDI  (via drill 0.33)
  Top 0.152: v58.42,19.81 56.59,21.64 52.63,21.64 IC1.11 | v67.72,20.73 v66.8,19.81 | v71.98,19.2 72.59,18.59 73.2,18.59 U3.45
  Bottom 0.152: v66.8,19.81 v58.42,19.81 | v67.72,20.73 70.46,20.73 v71.98,19.2
FTDI_ON  (via drill 0.33)
  Top 0.152: 71.83,22.55 73.2,22.55 U3.37 | 71.83,22.55 71.22,22.55 R10.1 | v56.13,23.77 52.63,23.77 IC1.14 | v69.39,26.36 71.22,24.54 71.68,24.54 71.83,24.38 71.83,22.55
  Bottom 0.152: v56.13,23.77 58.73,23.77 61.32,26.36 v69.39,26.36
GND  (via drill 0.33, 0.6)
  Top 0.152: U$3.1 69.09,62.48 57.51,62.48 U$4.1 57.35,62.33 53.39,62.33 38.46,47.4 38.46,39.17 P1.6 38.3,39.01 38.3,37.49 35.1,34.29 34.95,34.29 34.65,33.98 34.65,29.41 31.9,26.67 | C4.2 34.8,20.27 33.73,20.27 C3.2 33.58,20.27 32.66,20.27 C2.2 32.51,20.27 32.51,24.23 | 32.51,24.23 32.51,26.06 31.9,26.67 | 31.9,26.67 31.6,26.98 U2.12 31.44,27.13 26.87,27.13 25.04,28.96 22,28.96 MUX3.3 21.84,29.11 21.23,29.11 20.17,30.18 20.17,34.9 16.05,39.01 16.05,39.93 MUX2.3 16.05,40.08 16.05,40.84 16.97,41.76 26.87,41.76 27.94,40.69 27.94,40.08 MUX1.3 | 81.43,11.12 79.45,11.12 78.99,11.58 78.99,11.73 R7.1 | 81.43,11.12 82.35,12.04 82.35,12.34 C23.2 82.5,12.5 82.5,13.41 C27.2 82.35,13.56 82.35,14.17 | 82.35,14.17 82.35,15.09 U3.63 | 82.35,24.54 82.35,24.08 83.72,22.71 84.63,22.71 U3.12 84.78,22.55 85.55,22.55 86,22.1 86.61,22.1 C9.2 86.77,21.95 87.38,21.34 87.38,19.81 86.77,19.2 86.77,18.9 C19.2 86.77,18.75 86.77,16.61 LED1.C 86.77,16.46 85.55,16.46 83.26,14.17 82.35,14.17 | 82.35,24.54 82.35,26.36 U3.18 82.35,26.52 82.35,27.43 82.65,27.74 82.65,28.04 C20.2 82.65,28.19 82.65,29.11 C25.2 82.8,29.26 83.72,30.18 90.58,30.18 90.88,30.48 92.71,30.48 MUX0.3 | 82.35,24.54 76.86,24.54 75.79,25.6 75.79,26.36 U3.31 75.64,26.52 75.64,27.74 75.34,28.04 C28.2 75.34,28.19 75.34,29.11 C24.2 75.34,29.26 75.79,29.72 76.56,29.72 C10.2 76.71,29.87 78.38,31.55 89.05,31.55 94.69,37.19 96.06,37.19 97.13,38.25 97.13,39.47 P3.3 | v93.66,3.83 93.78,3.81 94.54,3.81 v94.68,3.83 94.69,3.96 94.69,4.72 v94.68,4.85 94.54,4.88 93.78,4.88 | v93.66,7.89 93.78,7.92 94.54,7.92 v94.68,7.89 94.69,7.77 94.69,7.01 v94.68,6.88
  Top 0.152: v94.68,6.88 94.69,6.86 94.69,5.94 v94.68,5.86 94.54,5.94 93.78,5.94 v93.66,5.86 93.78,5.79 93.78,4.88 | v94.68,6.88 94.54,6.86 93.78,6.86 v93.66,6.88 93.62,6.86 92.71,6.86 | 93.78,4.88 v93.66,4.85 | U1.P30 90.58,1.98 90.58,2.9 U1.P29 90.73,2.9 91.34,2.9 v91.49,2.74 | v92.65,3.83 92.71,3.96 92.71,4.72 v92.65,4.85 92.71,4.88 92.71,5.79 v92.65,5.86 92.71,5.94 92.71,6.86 | v92.65,8.91 92.56,8.99 91.64,8.99 U1.P18 91.49,9.14 91.49,9.6 90.73,10.36 90.73,10.67 U1.P16 | v92.65,8.91 92.71,8.84 92.71,7.92 v92.65,7.89 92.71,7.77 92.71,7.01 v92.65,6.88 92.71,6.86 | v98.74,3.83 98.81,3.81 99.42,3.2 99.42,1.98 U1.P45 99.42,1.83 99.42,1.22 98.65,0.46 85.7,0.46 84.48,1.68 | U1.P46 99.42,4.57 98.81,3.96 v98.74,3.83 | v96.71,3.83 96.83,3.81 97.59,3.81 v97.73,3.83 | v97.73,3.83 97.74,3.96 97.74,4.72 v97.73,4.85 97.59,4.88 96.83,4.88 | v98.74,5.86 98.81,5.94 98.81,6.86 v98.74,6.88 98.65,6.86 97.74,6.86 | v96.71,7.89 96.83,7.92 97.59,7.92 v97.73,7.89 97.74,7.77 97.74,7.01 v97.73,6.88 | 97.74,6.86 97.74,5.94 v97.73,5.86 97.59,5.94 96.83,5.94 v96.71,5.86 96.83,5.79 96.83,4.88 | v97.73,6.88 97.59,6.86 96.83,6.86 v96.71,6.88 96.67,6.86 95.76,6.86 | 97.74,6.86 v97.73,6.88 | 96.83,4.88 v96.71,4.85 | v98.74,3.83 98.65,3.81 97.74,3.81 v97.73,3.83 | U1.P47 99.42,8.08 98.65,8.84 v98.74,8.91 | U1.P2 98.81,9.75 98.81,8.99 v98.74,8.91 | 97.74,10.82 98.2,10.82 U1.P3 98.35,10.82 99.42,10.82 U1.P1 | 97.74,10.82 97.28,10.82 U1.P5 | 97.74,8.99 97.74,9.75 U1.P4 97.74,9.91 97.74,10.82 | v95.7,3.83 95.76,3.96 95.76,4.72 v95.7,4.85 95.76,4.88 95.76,5.79 v95.7,5.86 95.76,5.94 95.76,6.86 | v95.7,8.91 95.61,8.99 94.69,8.99 v94.68,8.91 94.54,8.99 93.78,8.99 v93.66,8.91 93.62,8.99 92.71,8.99 v92.65,8.91
  Top 0.152: v95.7,8.91 95.76,8.84 95.76,7.92 v95.7,7.89 95.76,7.77 95.76,7.01 v95.7,6.88 95.76,6.86 | v95.7,8.91 95.76,8.99 96.67,8.99 v96.71,8.91 96.83,8.99 97.59,8.99 v97.73,8.91 97.74,8.99 | 97.74,8.99 98.65,8.99 v98.74,8.91 | IC1.26 45.16,16.61 45.16,17.07 IC1.25 45.16,17.22 44.55,17.22 42.72,19.05 | 42.72,19.05 42.57,18.9 42.27,18.9 C8.2 42.11,18.75 41.2,18.75 C7.2 41.05,18.75 40.13,18.75 C6.2 39.98,18.75 39.06,18.75 C5.2 38.91,18.75 v38.91,15.7 | 42.72,19.05 43.33,19.66 45.16,19.66 IC1.21 45.31,19.81 46.84,19.81 47.14,20.12 47.14,20.73 46.23,21.64 45.31,21.64 IC1.18 | 84.48,1.68 84.33,1.68 83.11,0.46 74.27,0.46 73.51,1.22 | 84.48,1.68 84.63,1.68 J_BMD.5 84.48,1.68 | 73.51,1.22 73.36,1.37 73.36,1.83 J_ST.5 | U3.47 73.2,17.53 71.68,17.53 C26.2 71.53,17.37 70.76,17.37 C22.2 70.61,17.37 69.85,17.37 68.94,16.46 68.94,13.72 69.39,13.26 C11.2 69.55,13.11 69.55,12.19 | 69.55,12.19 69.55,11.12 C12.2 69.55,10.97 68.48,9.91 68.48,2.13 70,0.61 72.9,0.61 73.51,1.22 | 50.65,19.05 52.48,19.05 IC1.7 | 50.65,19.05 47.75,16.15 47.75,13.56 46.08,11.89 | 46.08,11.89 46.08,9.6 48.97,6.71 JP1.GND | 64.02,12.19 69.55,12.19 | P2.6 78.84,39.17 80.06,40.39 80.06,40.54 80.21,40.69 81.43,40.69 82.65,39.47 P2.4 | 46.08,11.89 44.55,13.41 36.78,13.41 X1.4 36.63,13.41 35.71,12.5 33.73,12.5 33.58,12.65 21.54,12.65 19.86,14.33 18.8,14.33 P4.2 | v81.43,10.97 81.43,11.12 | 32.51,24.23 45.92,24.23 50.65,19.51 50.65,19.05
  Top 1.016: P1.4 42.34,36.38 43.75,34.97 48.83,34.97 60.77,23.02 62.52,23.02 62.68,22.86 | 62.68,22.86 64.83,20.72 | P2.4 82.84,36.12 82.22,35.5 75.32,35.5 62.68,22.86
  Top 2.032: JP1.GND 51.47,7.8 JP1.GNDBREAK 53.17,7.95 54.73,9.52 62.55,9.52 64.02,10.98 64.02,12.19 U$6.1 64.02,19.91 64.83,20.72 C1.-
  Bottom 0.152: v91.49,2.74 92.56,3.81 v92.65,3.83 | v38.91,15.7 36.78,13.56 X1.4 | v81.43,10.97 83.87,10.97 86,8.84 92.56,8.84 v92.65,8.91
  pour Bottom (rank 2): 88.9,12.7 106.68,12.7 106.68,-2.54 88.9,-2.54
  pour Top: 88.9,12.7 106.68,12.7 106.68,-2.54 88.9,-2.54
  pour Top (rank 2): -2.54,66.04 106.68,66.04 106.68,12.7 88.9,12.7 88.9,-2.54 -2.54,-2.54
  pour Bottom: -5.08,68.58 109.22,68.58 109.22,12.7 88.9,12.7 88.9,-2.54 -5.08,-2.54
I2C0_SCL  (via drill 0.33)
  Top 0.152: R4.2 80.06,13.26 80.06,13.41 80.52,13.87 80.67,13.87 81.28,14.48 81.28,15.09 U3.61 81.28,15.24 81.28,16 81.13,16.15 v81.13,16.46 | v35.71,32.92 37.08,32.92 U2.22 | v35.86,35.97 35.86,36.42 v37.24,37.8
  Bottom 0.152: v35.71,32.92 35.71,33.22 35.86,33.38 v35.86,35.97 | v37.24,37.8 84.63,37.8 84.94,38.1 85.85,38.1 86.31,37.64 86.31,25.3 81.13,20.12 v81.13,16.46
I2C0_SDA
  Top 0.152: R5.2 81.13,13.26 81.13,13.72 81.74,14.33 81.74,15.09 U3.62 81.74,15.24 81.74,18.14 73.36,26.52 73.36,29.72 75.79,32.16 80.06,32.16 83.72,35.81 83.72,40.54 83.26,41 78.54,41 75.03,37.49 47.75,37.49 47.6,37.64 47.6,40.08 46.99,40.69 39.67,40.69 39.52,40.54 39.52,35.2 38,33.68 37.24,33.68 U2.23
I2C1_SCL  (via drill 0.33)
  Top 0.152: U3.29 76.86,26.52 76.86,27.43 77.62,28.19 77.62,28.35 R6.2 77.78,28.5 78.99,28.5 79.3,28.8 79.3,29.72 v78.84,30.18 | v77.47,31.55 77.93,31.55 78.23,31.85 80.21,31.85 v84.33,35.97 84.78,36.42 84.78,39.01 P2.3 | v43.64,36.58 44.25,37.19 44.25,39.01 P1.3
  Bottom 0.152: v77.47,31.55 v78.84,30.18 | P4.8 18.8,17.53 18.8,19.96 35.41,36.58 v43.64,36.58 43.79,36.73 44.7,36.73 45.47,35.97 v84.33,35.97
I2C1_SDA  (via drill 0.33)
  Top 0.152: R3.2 77.93,13.26 77.93,14.02 78.23,14.33 78.23,15.09 U3.55 78.23,15.24 v78.23,20.73 | v85.4,37.19 86.77,38.56 86.77,39.01 P2.2 | v44.4,36.12 46.23,37.95 46.23,39.01 P1.2
  Bottom 0.152: v78.23,20.73 78.23,24.38 82.8,28.96 85.09,28.96 85.4,29.26 85.4,35.36 | v85.4,37.19 85.4,35.36 | P4.7 21.69,17.53 25.5,17.53 44.09,36.12 v44.4,36.12 45.16,35.36 85.4,35.36
N$1
  Top 0.152: R1.2 28.85,32.31 30.07,32.31 30.68,32.92 31.44,32.92 U2.3
N$2
  Top 0.152: C4.1 34.95,18.9 36.17,18.9 36.78,18.29 F1.1 36.78,18.14 36.78,15.54 X1.1
N$3
  Top 0.152: LED1.A 88.44,16.46 88.44,15.24 R2.2
N$4
  Top 0.152: C19.1 86.61,20.12 84.78,20.12 U3.7
N$5
  Top 0.152: R7.2 78.99,13.26 78.99,13.41 79.76,14.17 80.52,14.17 80.67,14.33 80.67,15.09 U3.60
PWM_B  (via drill 0.33)
  Top 0.152: v80.37,25.15 79.76,25.76 79.76,26.36 U3.23 | v85.4,26.82 88.9,26.82 v90.27,28.19 | v99.72,37.64 100.03,37.95 100.03,39.47 P3.7
  Bottom 0.152: v80.37,25.15 83.87,25.15 85.4,26.67 v85.4,26.82 | v99.72,37.64 v90.27,28.19
PWM_G  (via drill 0.33)
  Top 0.152: v80.06,29.57 80.21,29.41 80.21,26.52 U3.22 | v81.89,30.63 82.35,30.63 82.65,30.94 89.36,30.94 95,36.58 97.74,36.58 99.42,38.25 99.42,39.47 P3.6
  Bottom 0.152: v80.06,29.57 80.82,29.57 v81.89,30.63
PWM_R
  Top 0.152: U3.21 80.67,26.52 80.67,30.33 81.59,31.24 89.2,31.24 94.84,36.88 97.28,36.88 98.65,38.25 98.65,39.47 P3.5
RTS_BMD  (via drill 0.33)
  Top 0.152: v88.59,9.45 90.58,7.47 U1.P21 | v86.16,24.23 85.55,23.62 84.78,23.62 U3.14
  Bottom 0.152: v88.59,9.45 88.59,12.34 86.16,14.78 v86.16,24.23 89.81,24.23 95.3,29.72 95.3,30.33 95,30.63 94.39,30.63 91.34,27.58 89.97,27.58 89.66,27.89 89.66,35.2 86.16,38.71 32.51,38.71 11.63,17.83 11.63,16.92 12.24,16.31 13,16.31 14.07,17.37 15.6,17.37 P4.9
RTS_FTDI  (via drill 0.33)
  Top 0.152: v54,17.37 53.24,16.61 52.63,16.61 IC1.3 | v70.92,25.76 73.51,25.76 75.34,23.93 75.34,19.81 74.73,19.2 73.36,19.2 U3.44
  Bottom 0.152: v54,17.37 54,18.59 61.16,25.76 v70.92,25.76
RXD_BMD  (via drill 0.33)
  Top 0.152: v84.33,11.43 89.97,5.79 91.49,5.79 U1.P24 | v83.57,25.76 84.63,24.69 U3.16
  Bottom 0.152: v84.33,11.43 84.33,11.89 82.8,13.41 | 82.8,13.41 79.76,16.46 79.76,25.45 80.06,25.76 v83.57,25.76 | 82.8,13.41 71.98,2.59 71.98,0.91 71.68,0.61 30.99,0.61 17.27,14.33 15.75,14.33 P4.3
RXD_FTDI  (via drill 0.33)
  Top 0.152: v59.94,17.98 52.63,17.98 IC1.5 | v68.33,17.98 69.55,17.98 71.68,20.12 73.2,20.12 U3.42
  Bottom 0.152: v68.33,17.98 v59.94,17.98
SC0  (via drill 0.33)
  Top 0.152: v32.66,37.34 34.04,35.97 34.04,32.46 33.27,31.7 31.6,31.7 U2.5 | v94.69,30.02 94.39,30.02 93.47,29.11 92.86,29.11 MUX0.2
  Bottom 0.152: v32.66,37.34 33.12,37.34 34.19,38.41 86,38.41 89.36,35.05 89.36,27.74 89.81,27.28 91.95,27.28 v94.69,30.02
SC1
  Top 0.152: U2.7 31.44,30.48 29.01,30.48 27.94,31.55 27.94,37.19 29.46,38.71 29.46,39.93 MUX1.2
SC2
  Top 0.152: U2.9 31.44,29.11 27.48,29.11 17.58,39.01 17.58,39.93 MUX2.2
SC3
  Top 0.152: U2.11 31.44,27.89 26.57,27.89 23.98,30.48 22,30.48 MUX3.2
SC4  (via drill 0.33)
  Top 0.152: v52.02,27.89 37.24,27.89 U2.14 | v84.78,32.46 89.51,32.46 95,37.95 96.06,37.95 96.37,38.25 96.37,39.47 P3.2
  Bottom 0.152: v52.02,27.89 72.44,27.89 77.01,32.46 v84.78,32.46
SD0  (via drill 0.33)
  Top 0.152: v32.97,32.31 31.6,32.31 U2.4 | v84.78,29.57 89.97,29.57 91.8,27.74 92.71,27.74 MUX0.1
  Bottom 0.152: v32.97,32.31 32.97,30.18 20.62,17.83 20.62,16.92 21.23,16.31 32.21,16.31 43.18,27.28 72.29,27.28 77.17,32.16 82.19,32.16 v84.78,29.57
SD1
  Top 0.152: U2.6 31.6,31.09 33.12,31.09 34.34,32.31 34.34,36.73 31.14,39.93 MUX1.1
SD2
  Top 0.152: U2.8 31.44,29.72 29.16,29.72 18.95,39.93 MUX2.1
SD3
  Top 0.152: U2.10 31.44,28.5 26.42,28.5 22.91,32 22,32 MUX3.1
SD4  (via drill 0.33)
  Top 0.152: v42.11,27.13 37.24,27.13 U2.13 | v84.78,33.38 89.51,33.38 95.61,39.47 P3.1
  Bottom 0.152: v42.11,27.13 42.57,27.13 48.82,33.38 v84.78,33.38
SWCLK_BMD
  Top 0.152: U1.P43 98.2,1.83 97.74,1.37 89.51,1.37 86.46,4.42 84.78,4.42 83.57,3.2 J_BMD.4
SWCLK_ST
  Top 0.152: J_ST.4 71.98,3.2 71.98,5.49 75.18,8.69 75.18,15.09 U3.49
SWDIO_BMD  (via drill 0.33)
  Top 0.152: v98.35,1.07 98.81,1.52 98.81,2.74 U1.P44 | v82.8,3.81 82.19,3.2 J_BMD.2
  Bottom 0.152: v98.35,1.07 87.68,1.07 86.31,2.44 84.18,2.44 v82.8,3.81
SWDIO_ST
  Top 0.152: J_ST.2 70.76,3.2 70.76,4.72 74.42,8.38 74.42,17.83 74.27,17.98 73.36,17.98 U3.46
TXD_BMD  (via drill 0.33)
  Top 0.152: v87.99,13.87 87.99,9.14 90.27,6.86 91.49,6.86 U1.P22 | v87.99,23.32 84.94,26.36 82.8,26.36 U3.17
  Bottom 0.152: v87.99,13.87 v87.99,23.32 89.36,23.32 100.33,34.29 100.33,37.95 99.26,39.01 29.77,39.01 5.54,14.78 5.54,14.02 6.15,13.41 10.11,13.41 11.02,14.33 12.55,14.33 P4.4
TXD_FTDI  (via drill 0.33)
  Top 0.152: v56.9,15.24 52.63,15.24 IC1.1 | v68.33,16.31 70.31,18.29 v71.98,18.29 | v74.73,20.12 74.27,19.66 73.36,19.66 U3.43
  Bottom 0.152: v56.9,15.24 67.26,15.24 v68.33,16.31 | v71.98,18.29 72.9,18.29 v74.73,20.12
USB_D+
  Top 0.152: 32.66,15.54 32.66,14.94 34.04,13.56 X1.3 | 32.66,15.54 32.66,18.9 C2.1 32.66,19.05 33.12,19.51 37.24,19.51 41.35,23.62 45.16,23.62 IC1.15 | 32.66,15.54 12.39,15.54 11.33,14.48 9.8,14.48 P4.5
USB_D-
  Top 0.152: C3.1 33.73,18.9 33.73,15.85 34.04,15.54 X1.2 34.19,15.39 35.1,14.48 45.77,14.48 47.45,16.15 47.45,21.49 45.92,23.01 45.31,23.01 IC1.16
  Bottom 0.152: P4.6 6.76,14.48 8.28,14.48 9.65,15.85 33.73,15.85 34.04,15.54 X1.2
VCAP
  Top 0.152: C10.1 76.56,28.35 76.56,27.58 76.25,27.28 U3.30
VIN_DC  (via drill 0.33)
  Top 0.152: v65.58,10.97 67.72,10.97 C12.1
  Top 2.032: JP1.PWR 50.39,10.8 52.17,12.58 56.37,12.58 U$6.3
  Bottom 0.152: v65.58,10.97 48.67,10.97 48.51,10.82 JP1.PWR 48.36,10.82 46.53,12.65 40.59,12.65 40.44,12.5 33.73,12.5 31.9,14.33 21.69,14.33 P4.1
VSS(GND)  (via drill 0.33)
  Top 0.152: v82.8,1.07 83.41,1.68 J_BMD.3 | v72.59,1.22 71.98,1.83 J_ST.3
  Bottom 0.152: v82.8,1.07 75.49,1.07 74.88,0.46 73.36,0.46 v72.59,1.22

### Text on the board
tNames: NSVR | Hardlight 1